# Altium schematic sheet 3-MCU.SCHDOC
size A4
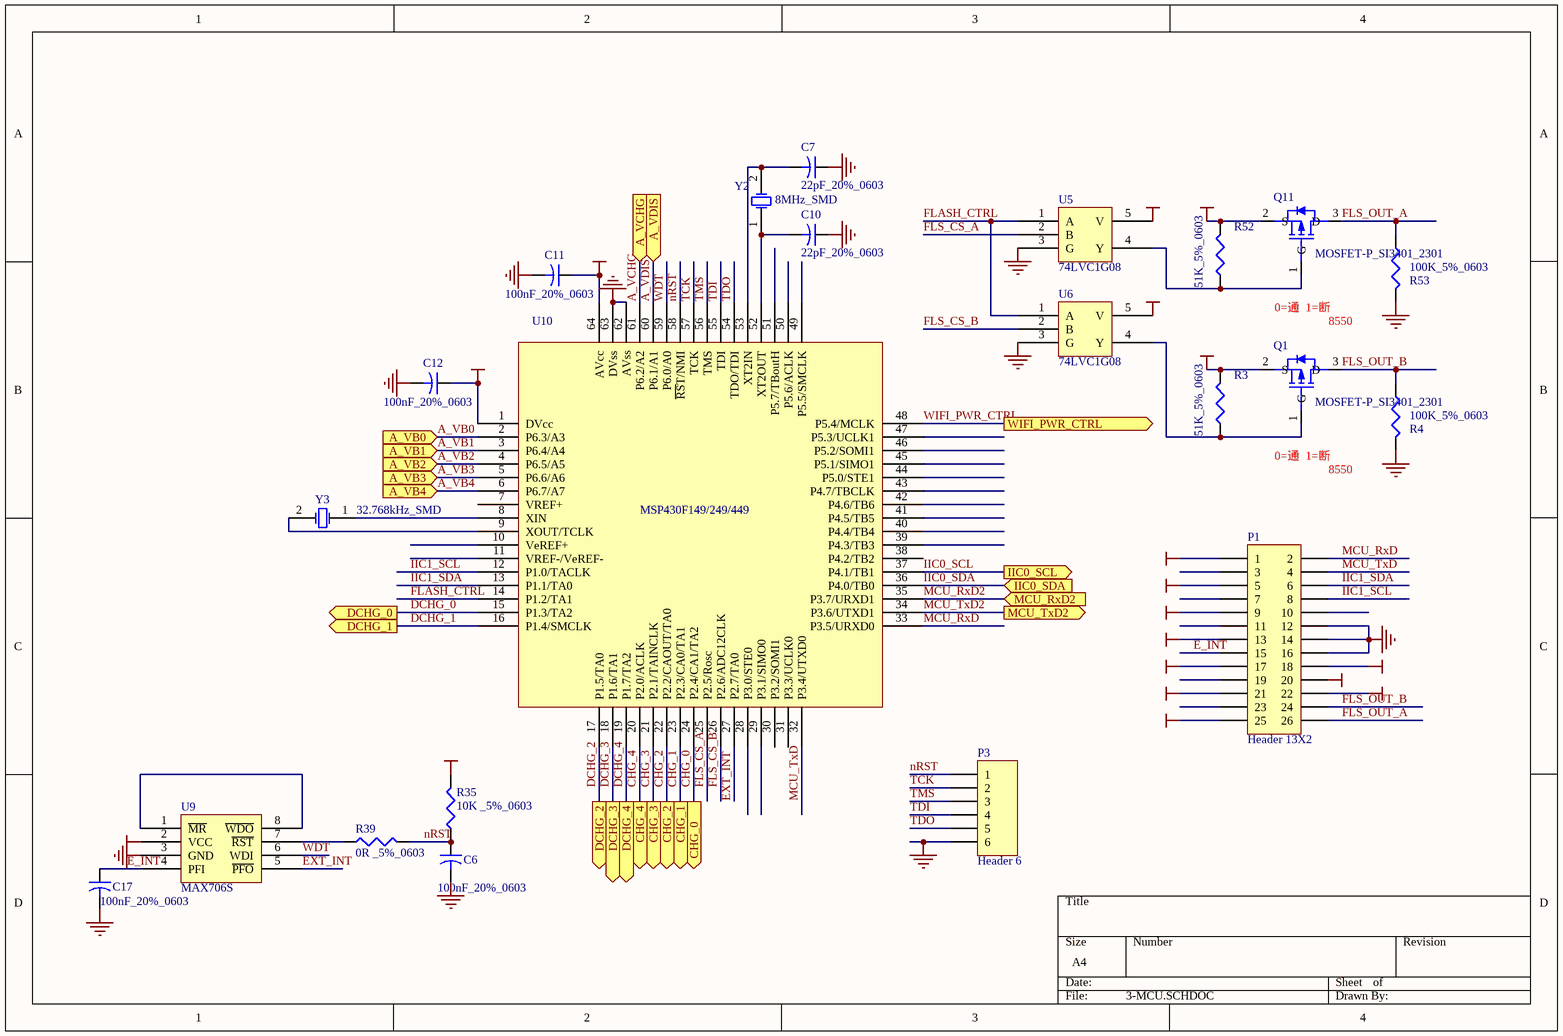
[diagram p0: 3-MCU.SCHDOC]

## Parts
C6  100nF_20%_0603  [C1608-0603]
C7  22pF_20%_0603  [C1608-0603]
C10  22pF_20%_0603  [C1608-0603]
C11  100nF_20%_0603  [C1608-0603]
C12  100nF_20%_0603  [C1608-0603]
C17  100nF_20%_0603  [C1608-0603]
P1  Header 13X2  [HDR2.54_2x13]
P3  Header 6  [SH-06S]
Q1  MOSFET-P_SI3401_2301  [SO-G3/C2.5]
Q11  MOSFET-P_SI3401_2301  [SO-G3/C2.5]
R3  51K_5%_0603  [C1608-0603]
R4  100K_5%_0603  [C1608-0603]
R35  10K _5%_0603  [C1608-0603]
R39  0R _5%_0603  [C1608-0603]
R52  51K_5%_0603  [C1608-0603]
R53  100K_5%_0603  [C1608-0603]
U5  74LVC1G08  [SOT23-5]
U6  74LVC1G08  [SOT23-5]
U9  MAX706S  [SO-8]
U10  MSP430F149/249/449  [QFP-64]
Y2  8MHz_SMD  [XTAL-P4mm_SMD]
Y3  32.768kHz_SMD  [XTAL-3216]

## Ports
A_VB0 (in), A_VB1 (in), A_VB2 (in), A_VB3 (in), A_VB4 (in), A_VCHG (in), A_VDIS (in), CHG_0 (out), CHG_1 (out), CHG_2 (out), CHG_3 (out), CHG_4 (out), DCHG_0 (out), DCHG_1 (out), DCHG_2 (out), DCHG_3 (out), DCHG_4 (out), IIC0_SCL (out), IIC0_SDA (in), MCU_RxD2 (in), MCU_TxD2 (out), WIFI_PWR_CTRL (out)

## Nets
GND: C6.2 C7.1 C10.1 C11.2 C12.2 C17.2 P1.12 P1.14 P1.16 P3.6 R4.2 R53.2 U5.3(G) U6.3(G) U9.3(GND) U10.62(AVss) U10.63(DVss)
V_BT0: P1.1
V_BT1: P1.5
V_BT2: P1.9
V_BT3: P1.13
V_BT4: P1.17 P1.18
VCC_2V8: C11.1 C12.1 P1.20 Q1.2(S) Q11.2(S) R3.2 R35.2 R52.2 U5.5(V) U6.5(V) U9.2(VCC) U10.1(DVcc) U10.64(AVcc)
VCC_BAT: P1.25
VCC_CHARGE: P1.21 P1.22
A_VB0: U10.2(P6.3/A3) ; port A_VB0
A_VB1: U10.3(P6.4/A4) ; port A_VB1
A_VB2: U10.4(P6.5/A5) ; port A_VB2
A_VB3: U10.5(P6.6/A6) ; port A_VB3
A_VB4: U10.6(P6.7/A7) ; port A_VB4
A_VCHG: U10.61(P6.2/A2) ; port A_VCHG
A_VDIS: U10.60(P6.1/A1) ; port A_VDIS
CHG_0: U10.24(P2.4/CA1/TA2) ; port CHG_0
CHG_1: U10.23(P2.3/CA0/TA1) ; port CHG_1
CHG_2: U10.22(P2.2/CAOUT/TA0) ; port CHG_2
CHG_3: U10.21(P2.1/TAINCLK) ; port CHG_3
CHG_4: U10.20(P2.0/ACLK) ; port CHG_4
DCHG_0: U10.15(P1.3/TA2) ; port DCHG_0
DCHG_1: U10.16(P1.4/SMCLK) ; port DCHG_1
DCHG_2: U10.17(P1.5/TA0) ; port DCHG_2
DCHG_3: U10.18(P1.6/TA1) ; port DCHG_3
DCHG_4: U10.19(P1.7/TA2) ; port DCHG_4
E_INT: C17.1 P1.15 U9.4(PFI)
EXT_INT: U9.5(~{PFO}) U10.27(P2.7/TA0)
FLASH_CTRL: U5.1(A) U6.1(A) U10.14(P1.2/TA1)
FLS_CS_A: U5.2(B) U10.25(P2.5/Rosc)
FLS_CS_B: U6.2(B) U10.26(P2.6/ADC12CLK)
FLS_OUT_A: P1.26 Q11.3(D) R53.1
FLS_OUT_B: P1.24 Q1.3(D) R4.1
IIC0_SCL: U10.37(P4.1/TB1) ; port IIC0_SCL
IIC0_SDA: U10.36(P4.0/TB0) ; port IIC0_SDA
IIC1_SCL: P1.8 U10.12(P1.0/TACLK)
IIC1_SDA: P1.6 U10.13(P1.1/TA0)
MCU_RxD: P1.2 U10.33(P3.5/URXD0)
MCU_RxD2: U10.35(P3.7/URXD1) ; port MCU_RxD2
MCU_TxD: P1.4 U10.32(P3.4/UTXD0)
MCU_TxD2: U10.34(P3.6/UTXD1) ; port MCU_TxD2
nRST: C6.1 P3.1 R35.1 R39.2 U10.58(~{RS}T/NMI)
TCK: P3.2 U10.57(TCK)
TDI: P3.4 U10.55(TDI)
TDO: P3.5 U10.54(TDO/TDI)
TMS: P3.3 U10.56(TMS)
WDT: U9.6(WDI) U10.59(P6.0/A0)
WIFI_PWR_CTRL: U10.48(P5.4/MCLK) ; port WIFI_PWR_CTRL
NetC7_2: C7.2 U10.53(XT2IN) Y2.2(OSC2)
NetC10_2: C10.2 U10.52(XT2OUT) Y2.1(OSC1)
NetQ1_1: Q1.1(G) R3.1 U6.4(Y)
NetQ11_1: Q11.1(G) R52.1 U5.4(Y)
NetR39_1: R39.1 U9.7(~{RST})
NetU9_1: U9.1(~{MR}) U9.8(~{WDO})
NetU10_8: U10.8(XIN) Y3.1(OSC1)
NetU10_9: U10.9(XOUT/TCLK) Y3.2(OSC2)

Not connected (* = marked no-connect by the designer): P1 3 7 10 11 19 23; U10 7(VREF+) 10(VeREF+) 11(VREF-/VeREF-) 28(P3.0/STE0) 29(P3.1/SIMO0) 30(P3.2/SOMI1) 31(P3.3/UCLK0) 38(P4.2/TB2) 39(P4.3/TB3) 40(P4.4/TB4) 41(P4.5/TB5) 42(P4.6/TB6) 43(P4.7/TBCLK) 44(P5.0/STE1) 45(P5.1/SIMO1) 46(P5.2/SOMI1) 47(P5.3/UCLK1) 49(P5.5/SMCLK) 50(P5.6/ACLK) 51(P5.7/TBoutH)

## Notes on the sheet
- 0=通  1=断
- 8550

## Library data of the parts
C6 C17 = Cap2: Capacitor; Value: 0.1uF 0603; Published: 23-Sep-2002; Publisher: Altium Limited
C7 C10-C12 = Cap2: Capacitor; Value: 0.1uF 20% 0603; Published: 23-Sep-2002; Publisher: Altium Limited
P1 = Header 13X2: Header, 13-Pin, Dual row; LatestRevisionDate: 17-Jul-2002; LatestRevisionNote: Re-released for DXP Platform.; Publisher: Altium Limited
P3 = Header 6: Header, 6-Pin; LatestRevisionDate: 17-Jul-2002; LatestRevisionNote: Re-released for DXP Platform.; Publisher: Altium Limited
Q1 Q11 = MOSFET-P
R3 R4 R52 R53 = Res3: Resistor; Published: 8-Jun-2000; Revision: July-2002: Re-released for DXP Platform.; Publisher: Altium Limited
R35 R39 = Res3: Resistor; Value: 1M %5 0603_NC; Published: 8-Jun-2000; Revision: July-2002: Re-released for DXP Platform.; Publisher: Altium Limited
U9 = MAX706
Y2 Y3 = XTAL: Crystal Oscillator; Published: 8-Jun-2000; Revision: July-2002: Re-released for DXP Platform.; Publisher: Altium Limited